# Altium project Mini_sys.PrjPcb
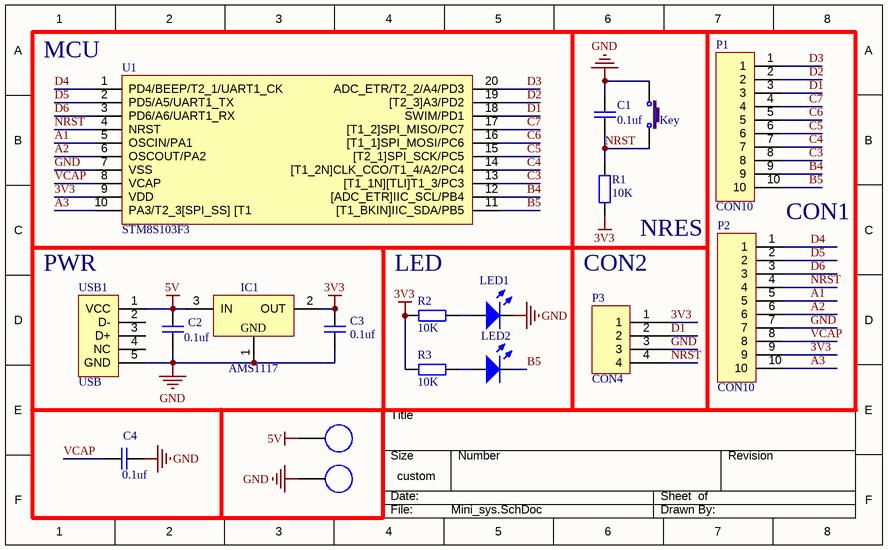
[diagram p0: Mini_sys.SchDoc]
1 sheet, 18 parts. Net scope: global (net labels, ports and power ports of the same name join across sheets).
Board files: Mini_sys.PcbDoc, PCB_Pin.PcbDoc

## Sheet Mini_sys.SchDoc
size 165 x 101 mm; SheetNumber: 1; SheetTotal: 1

### Parts
C1  0.1uf  [C0603]
C2  0.1uf  [C0603]
C3  0.1uf  [C0603]
C4  0.1uf  [C0603]
IC1  AMS1117  [SOT223_N]
Key1  Key  [TSW SMD-3*6*2.5]
LED1  LED  [LED 0805]  (value not drawn)
LED2  LED  [LED 0805]  (value not drawn)
O1  过孔  [过孔]  (value not drawn)
O2  过孔  [过孔]  (value not drawn)
P1  CON10  [HDR2.54-LI-10P]
P2  CON10  [HDR2.54-LI-10P]
P3  CON4  [HDR2.54-WI-4P]
R1  10K  [R 0603]
R2  10K  [0402r]
R3  10K  [0402r]
U1  STM8S103F3  [TSSOP20_L]
USB1  USB  [USB-MICRO_E]

### Nets
3V3: C3.1 IC1.2(OUT) P2.9 P3.1 R1.1 R2.1 R3.1 U1.9(VDD)
5V: C2.1 IC1.3(IN) O1.0 USB1.1(VCC)
GND: C1.2 C2.2 C3.2 C4.2 IC1.1(GND) Key1.1 LED1.2 O2.0 P2.7 P3.3 U1.7(VSS) USB1.5(GND)
A1: P2.5 U1.5(OSCIN/PA1)
A2: P2.6 U1.6(OSCOUT/PA2)
A3: P2.10 U1.10(PA3/T2_3[SPI_SS]_[T1)
B4: P1.9 U1.12([ADC_ETR]IIC_SCL/PB4)
B5: LED2.2 P1.10 U1.11([T1_BKIN]IIC_SDA/PB5)
C3: P1.8 U1.13([T1_1N][TLI]T1_3/PC3)
C4: P1.7 U1.14([T1_2N]CLK_CCO/T1_4/A2/PC4)
C5: P1.6 U1.15([T2_1]SPI_SCK/PC5)
C6: P1.5 U1.16([T1_1]SPI_MOSI/PC6)
C7: P1.4 U1.17([T1_2]SPI_MISO/PC7)
D1: P1.3 P3.2 U1.18(SWIM/PD1)
D2: P1.2 U1.19([T2_3]A3/PD2)
D3: P1.1 U1.20(ADC_ETR/T2_2/A4/PD3)
D4: P2.1 U1.1(PD4/BEEP/T2_1/UART1_CK)
D5: P2.2 U1.2(PD5/A5/UART1_TX)
D6: P2.3 U1.3(PD6/A6/UART1_RX)
NRST: C1.1 Key1.2 P2.4 P3.4 R1.2 U1.4(NRST)
VCAP: C4.1 P2.8 U1.8(VCAP)
NetLED1_1: LED1.1 R2.2
NetLED2_1: LED2.1 R3.2

Not connected (* = marked no-connect by the designer): USB1 2(D-) 3(D+) 4(NC)

### Notes on the sheet
- (near U1) MCU
- CON1
- PWR
- LED
- CON2
- (near R1) NRES
- DWG. NO.
- REV.
- SHT.
- THIS DOCUMENT AND THE DATA DISCLOSED HEREIN OR HEREWITH IS THE PROPERTY OF ALTIUM LIMITED AND MAY BE FREELY DISTRIBUTED IN WHOLE. NO RIGHTS ARE RESERVED OR EXPRESS OR IMPLIED WARANTEE GIVEN.
- REVISION
- DESCRIPTION
- DATE
- APPROVED
- ENG:
- APPROVALS
- PROJECT
- DSN:
- CHK:
- REFERENCE DOCUMENTS
- PROJECT REVISION:
- TITLE
- DOCUMENT REVISION:
- DESIGN ITEM:
- BOM:
- FAB DWG:
- PCB DWG:
- ASSY DWG:
- SCALE:
- SIZE
- B
- CAGE CODE
- FILE NAME
- DWG NO.
- SHEET
- OF
- REV

### Library data of the parts
C1-C4 = Cap: 电容
Key1 = Key: 按键
P1 P2 = CON10: 插针
R1-R3 = Res: 电阻